# Altium schematic sheet LAB-05.SchDoc
size A
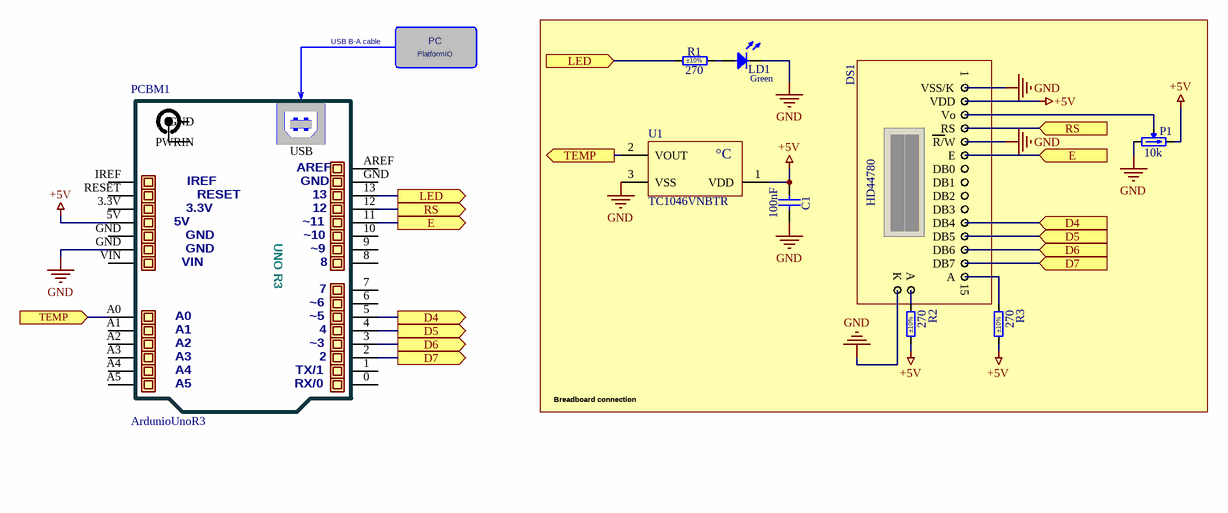
[diagram p0: LAB-05.SchDoc]

## Parts
C1  100nF  [CAPC0603X33N]
DS1  HD44780  [DS_POWERTIP_PC1202LRS-AWA-B]
LD1  Green  [LED_DIALIGHT_561-2201-050F]
P1  10k  [TRIM_BOURNS_3314G-1]
PCBM1  ArdunioUnoR3
R1  270  Tolerance: ±10%  [RESC3216X65N]
R2  270  Tolerance: ±10%  [RESC3216X65N]
R3  270  Tolerance: ±10%  [RESC3216X65N]
U1  TC1046VNBTR  [SOT-23-NB3_L]

## Blocks framed on the sheet
°C: C1 DS1 LD1 P1 R1-R3 U1

## Ports
D4 (in), D4 (out), D5 (in), D5 (out), D6 (in), D6 (out), D7 (in), D7 (out), E (in), E (out), LED (in), LED (out), RS (in), RS (out), TEMP (in), TEMP (out)

## Nets
+5V: C1.2 P1.3(CW) PCBM1.5V R2.2 R3.2 U1.1(VDD)
GND: C1.1 LD1.1(C) P1.1(CCW) PCBM1.GND U1.3(VSS)
D4: PCBM1.5 ; port D4
D5: PCBM1.4 ; port D5
D6: PCBM1.3 ; port D6
D7: PCBM1.2 ; port D7
E: PCBM1.11 ; port E
LED: PCBM1.13 R1.1 ; port LED
RS: PCBM1.12 ; port RS
TEMP: PCBM1.A0 U1.2(VOUT) ; port TEMP
NetLD1_2: LD1.2(A) R1.2

Not connected (* = marked no-connect by the designer): P1 2(W); PCBM1 0 1 3.3V 6 7 8 9 10 A1 A2 A3 A4 A5 AREF IREF RESET VIN; R2 1; R3 1

## Notes on the sheet
- PC
- USB B-A cable
- PlatformIO
- Breadboard connection
- (in symbol ArdunioUnoR3) PWRIN; USB; ~11; UNO R3; ~10; ~9; ~6; ~5; ~3; TX/1; RX/0
- (in symbol DS_POWERTIP_PC1202LRS-AWA-B) 1; VSS/K; VDD; Vo; RS; R/W; E; DB0; DB1; DB2; DB3; DB4; DB5; DB6; DB7; K; A; 15

## Library data of the parts
C1 = CC0201_100NF_6.3V_10%_X5R: Non-polarised capacitor; Part Description: SMD Multilayer Chip Ceramic Capacitor; Manufacturer: GENERIC; Manufacturer1 Part Number: 02016D104KAT2A; Voltage: 6.3V; TC: X5R; Tolerance: ±10%; Part Number: CC0201_100NF_6.3V_10%_X5R; Component Kind: Standard; Component Type: Standard; Pin Count: 2; Value: 100nF; Status: Not Recommended; Manufacturer Part Number: CC0201_100NF_6.3V_10%_X5R; Case: 0201; Mounted: Yes; Socket: No; SMD: Yes; Sense: No; Manufacturer1 Example: AVX; Manufacturer1 ComponentHeight: 0.33mm; HelpURL: \\cern.ch\dfs\Applications\Altium\Datasheets\CC0201_X5R_AVX.pdf; Author: CERN DEM JLC; CreateDate: 3. 12. 2007; LatestRevisionDate: 3. 12. 2007
DS1 = DS_POWERTIP_PC1202LRS-AWA-B: Alphanumeric LCD Display Module, 2 x 12 characters, Dot Size:0.45 x 0.60, Dot Pitch 0.55 x 0.70; Part Description: STN positive gray, Alphanumeric LCD Display Module, 2 x 12 characters With LED Backlight Yellow-Green; PressFit: No; Bonding: No; Part Number: DS_POWERTIP_PC1202LRS-AWA-B; Component Kind: Standard; Component Type: Standard; Device: PC1202LRS-AWA-B; PackageDescription: Alphanumeric LCD Display Module, 2 x 12 characters, Dot Size:0.45 x 0.60, Dot Pitch 0.55 x 0.70, With LED Backlight Yellow-Green; Manufacturer: POWERTIP; Manufacturer Part Number: PC1202LRS-AWA-B; Pin Count: 0; Mounted: Yes; Socket: No; SMD: No; Sense: No; ComponentHeight: 12.8mm; HelpURL: \\cern.ch\dfs\Applications\Altium\Datasheets\DS_POWERTIP_PC1202LRS-AWA-B.pdf; Author: CERN DEM JLC; CreateDate: 30. 5. 2011; LatestRevisionDate: 30. 5. 2011
LD1 = LED_DIALIGHT_561-2201-050F: LED Green 1C 2A; Part Description: Single Vertical 5mm HE Green LED With Housing Stand-off (D 7.1mmx H 6.985mm), Overall Height 12.7mm; PressFit: No; Bonding: No; Part Number: LED_DIALIGHT_561-2201-050F; Component Kind: Standard; Component Type: Standard; Color: Green; PackageDescription: Single Vertical 5mm HE Green LED With Housing Stand-off (D 7.1mmx H 6.985mm), Overall Height 12.7mm; Manufacturer: DIALIGHT; Manufacturer Part Number: 561-2201-050F; Pin Count: 2; Mounted: Yes; Socket: No; SMD: No; Sense: No; ComponentHeight: 12.7mm; HelpURL: \\cern.ch\dfs\Applications\Altium\Datasheets\LED_DIALIGHT_561-2201-050F.pdf; Author: CERN DEM JLC; CreateDate: 6. 6. 2018; LatestRevisionDate: 6. 6. 2018
P1 = TRIM_1T_10K_BOURNS_3314G-1-103E: Trimming Potentiometer; Part Description: Single Turn 4mm Square Trimpot® Trimming Potentiometer (Top Adjust); Manufacturer: BOURNS; Power: 0.25W; TC: ±100ppm/°C; Tolerance: ±20%; PressFit: No; Part Number: TRIM_1T_10K_BOURNS_3314G-1-103E; Component Kind: Standard; Component Type: Standard; Pin Count: 3; Value: 10k; Manufacturer Part Number: 3314G-1-103E; Case: 3314G-1; Mounted: Yes; Socket: No; SMD: Yes; Sense: No; ComponentHeight: 2.55mm; HelpURL: \\cern.ch\dfs\Applications\Altium\Datasheets\TRIM_BOURNS_3314G-1.pdf; Author: CERN DEM JLC; CreateDate: 4. 3. 2014; LatestRevisionDate: 4. 3. 2014
PCBM1 = ArdunioUnoR3: ArdunioUnoR3 Universal SCH Symbol / (C) 230232
R1-R3 = R1206_270R_0.1%_0.25W_25PPM: Resistor - 0.1%; Part Description: Thin Film Chip Resistor; Manufacturer: GENERIC; Manufacturer1 Part Number: RN73H2BTTD2700B25; Power: 0.25W; TC: ±25ppm/°C; PressFit: No; Part Number: R1206_270R_0.1%_0.25W_25PPM; Component Kind: Standard; Component Type: Standard; Pin Count: 2; Value: 270; Status: Not Recommended; Manufacturer Part Number: R1206_270R_0.1%_0.25W_25PPM; Case: 1206; Mounted: Yes; Sense: No; Socket: No; SMD: Yes; Manufacturer1 Example: KOA; Manufacturer1 ComponentHeight: 0.70mm; HelpURL: \\cern.ch\dfs\Applications\Altium\Datasheets\R1206_KOA_RN73H.pdf; Author: CERN DEM JLC; CreateDate: 3. 12. 2007; LatestRevisionDate: 13. 3. 2008
U1 = CMP-0192-00224-1: High Precision Temperature-to-Voltage Converter, 3-Pin SOT-23, Extended Temperature, Tape and Reel; Code_IPC: SOT23-3; PackageDescription: 3-Lead Plastic Small Outline Transistor (NB) [SOT-23]; PackageVersion: revBB, Aug-2009; DatasheetVersion: revB, Feb-2003; PackageReference: SOT-23-NB3